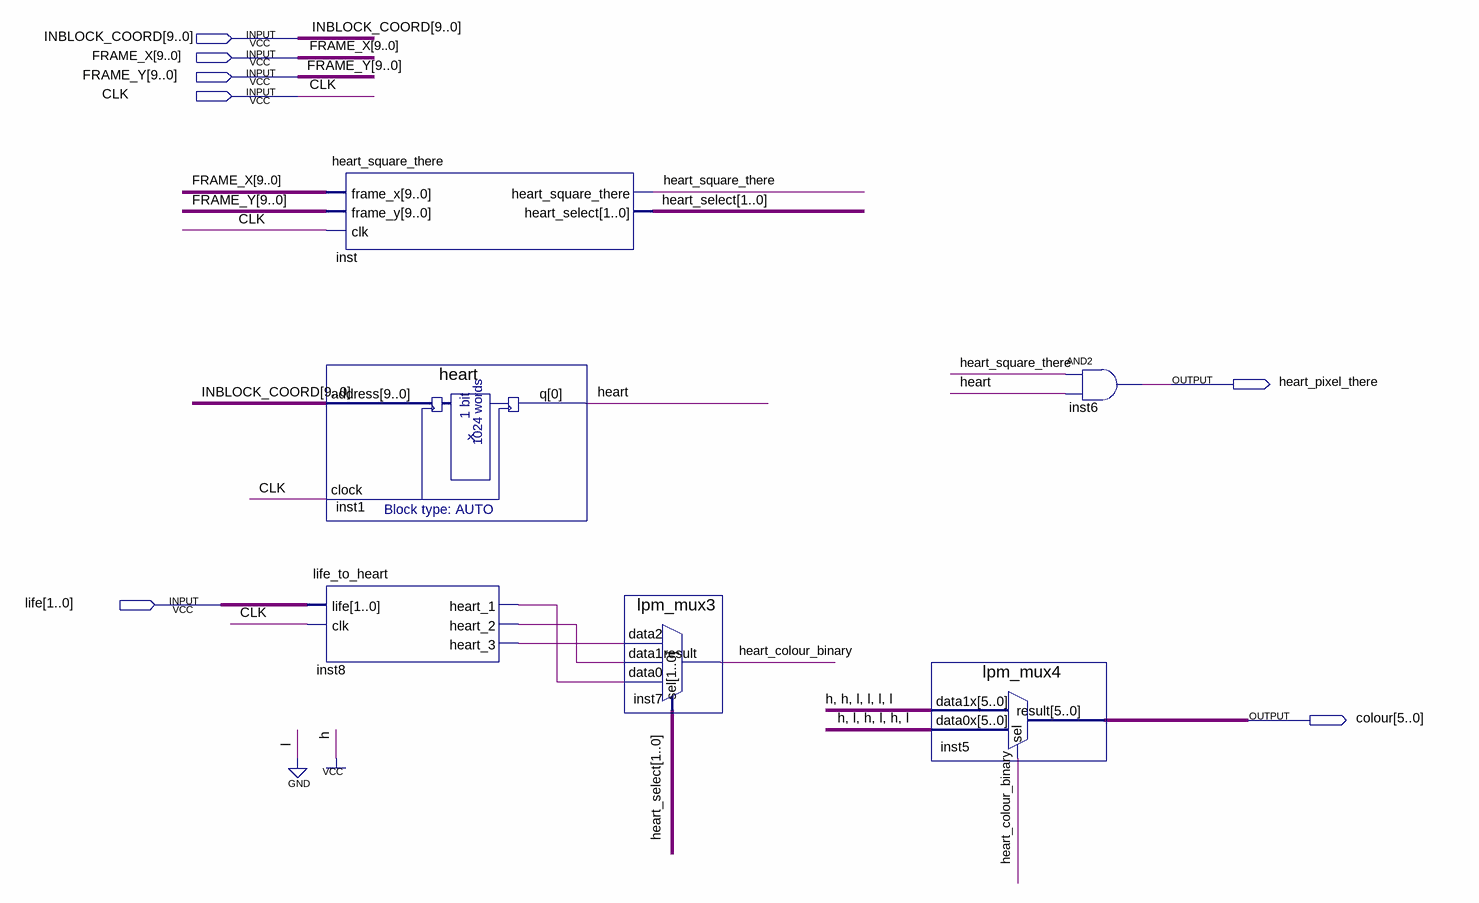
[diagram p0: schematic sheet]
// Quartus schematic print_heart.bdf as structural Verilog: 6 symbols, 7 pins
module print_heart (
  input  [9:0] INBLOCK_COORD,
  input  [9:0] FRAME_X,
  input  [9:0] FRAME_Y,
  input  CLK,
  input  [1:0] life,
  output heart_pixel_there,
  output [5:0] colour
);

  wire heart, heart_colour_binary, heart_square_there, inst8_heart_1, inst8_heart_2, inst8_heart_3;
  wire [1:0] heart_select;

  life_to_heart inst8 (
    .life(life), .clk(CLK), .heart_1(inst8_heart_1), .heart_2(inst8_heart_2), .heart_3(inst8_heart_3));
  heart_square_there inst (
    .frame_x(FRAME_X), .frame_y(FRAME_Y), .clk(CLK), .heart_square_there(heart_square_there),
    .heart_select(heart_select));
  heart inst1 (.address(INBLOCK_COORD), .clock(CLK), .q(heart));
  lpm_mux3 inst7 (
    .data2(inst8_heart_3), .data1(inst8_heart_2), .data0(inst8_heart_1), .sel(heart_select),
    .result(heart_colour_binary));
  lpm_mux4 inst5 (.data1x(6'b110000), .data0x(6'b101010), .sel(heart_colour_binary), .result(colour));
  and inst6 (heart_pixel_there, heart_square_there, heart);
endmodule
